# Altium project 8266HomeKitSwitch.PrjPcb
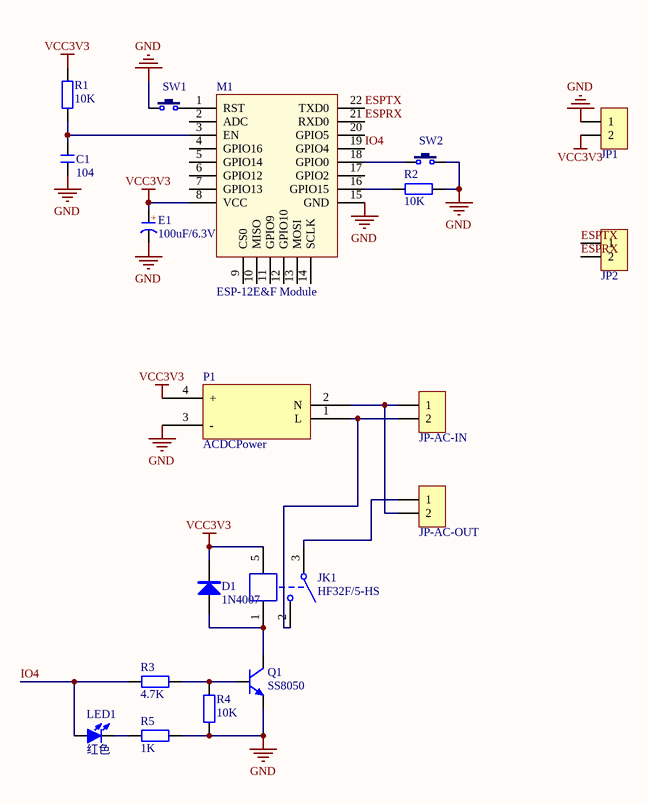
[diagram p0: 8266HomeKitSwitch.SchDoc]
1 sheet, 19 parts. Net scope: global (net labels, ports and power ports of the same name join across sheets).
Board file: 8266HomeKitSwitch.PcbDoc

## Sheet 8266HomeKitSwitch.SchDoc
size A4; SheetNumber: 1; SheetTotal: 1

### Parts
C1  104  [C 0603_L]
D1  1N4007  [SOD-123]
E1  100uF/6.3V  [CD A(3216)]
JK1  HF32F/5-HS  [JZC-32F_1H]
JP1  HDR-1X2  [HDR2.54-LI-2P]  (value not drawn)
JP2  HDR-1X2  [HDR2.54-LI-2P]  (value not drawn)
JP-AC-IN  HDR-1X2  [KF128-3.81-2P]  (value not drawn)
JP-AC-OUT  HDR-1X2  [KF128-3.81-2P]  (value not drawn)
LED1  红色  [LED 0603B]
M1  ESP-12E&F Module  [ESP-12E&F Module]
P1  ACDCPower  [ADDC]
Q1  SS8050  [SOT23-3N]
R1  10K  [R 0603_L]
R2  10K  [R 0603_L]
R3  4.7K  [R 0603_L]
R4  10K  [R 0603_L]
R5  1K  [R 0603_L]
SW1  3x4x5  [TS3x4x2]  (value not drawn)
SW2  3x4x5  [TS3x4x2]  (value not drawn)

### Nets
GND: C1.1 E1.2(K) JP1.1 M1.15(GND) P1.3(-) Q1.2(E) R2.1 R4.2 R5.1 SW1.1 SW2.2
VCC3V3: D1.2(K) E1.1(A) JK1.5 JP1.2 M1.8(VCC) P1.4(+) R1.2
ESPRX: JP2.2 M1.21(RXD0)
ESPTX: JP2.1 M1.22(TXD0)
IO4: LED1.1(A) M1.19(GPIO4) R3.2
NetC1_2: C1.2 M1.3(EN) R1.1
NetD1_1: D1.1(A) JK1.1 Q1.3(C)
NetJK1_2: JK1.2 JP-AC-IN.2 P1.1(L)
NetJK1_3: JK1.3 JP-AC-OUT.1
NetJP-AC-IN_1: JP-AC-IN.1 JP-AC-OUT.2 P1.2(N)
NetLED1_2: LED1.2(K) R5.2
NetM1_1: M1.1(RST) SW1.2
NetM1_16: M1.16(GPIO15) R2.2
NetM1_18: M1.18(GPIO0) SW2.1
NetQ1_1: Q1.1(B) R3.1 R4.1

Not connected (* = marked no-connect by the designer): M1 2(ADC) 4(GPIO16) 5(GPIO14) 6(GPIO12) 7(GPIO13) 9(CS0) 10(MISO) 11(GPIO9) 12(GPIO10) 13(MOSI) 14(SCLK) 17(GPIO2) 20(GPIO5)

### Notes on the sheet
- (in symbol C-CD) +

### Library data of the parts
C1 = C: 无极性贴片电容; 版权归属: 源创客; 材质: X7R; BOM名称: 无极性贴片电容; 学习资源: www.ooocke.com
D1 = 1N4007: 整流二极管; 版权归属: 源创客; BOM名称: 整流二极管; 学习资源: www.ooocke.com
E1 = C-CD: 贴片钽电容; 版权归属: 源创客; BOM名称: 贴片钽电容; 学习资源: www.ooocke.com
JK1 = HF32F/5-HS: 5V一组常开; BOM名称: 5V继电器; 版权归属: 源创客; 学习资源: www.ooocke.com
JP1 JP2 JP-AC-IN JP-AC-OUT = Header 2: 2P接插件; 版权归属: 源创客; BOM名称: 2P接插件; 学习资源: www.ooocke.com
LED1 = LED-SMD: 贴片LED; 版权归属: 源创客; BOM名称: 贴片LED; 学习资源: www.ooocke.com
Q1 = 8050-SMD: 高频放大-NPN型; 版权归属: 源创客; 属性: 40V 1.5A 1W 100MHZ; BOM名称: 高频放大-NPN型; 学习资源: www.ooocke.com
R1-R5 = R: 贴片电阻; 版权归属: 源创客; BOM名称: 贴片电阻; 学习资源: www.ooocke.com
SW1 SW2 = TS 3x4: 3x4轻触开关; BOM名称: 3x6轻触开关; 版权归属: 源创客; 学习资源: www.ooocke.com